# Altium schematic sheet [1]-COVER_PAGE.SchDoc
size A4
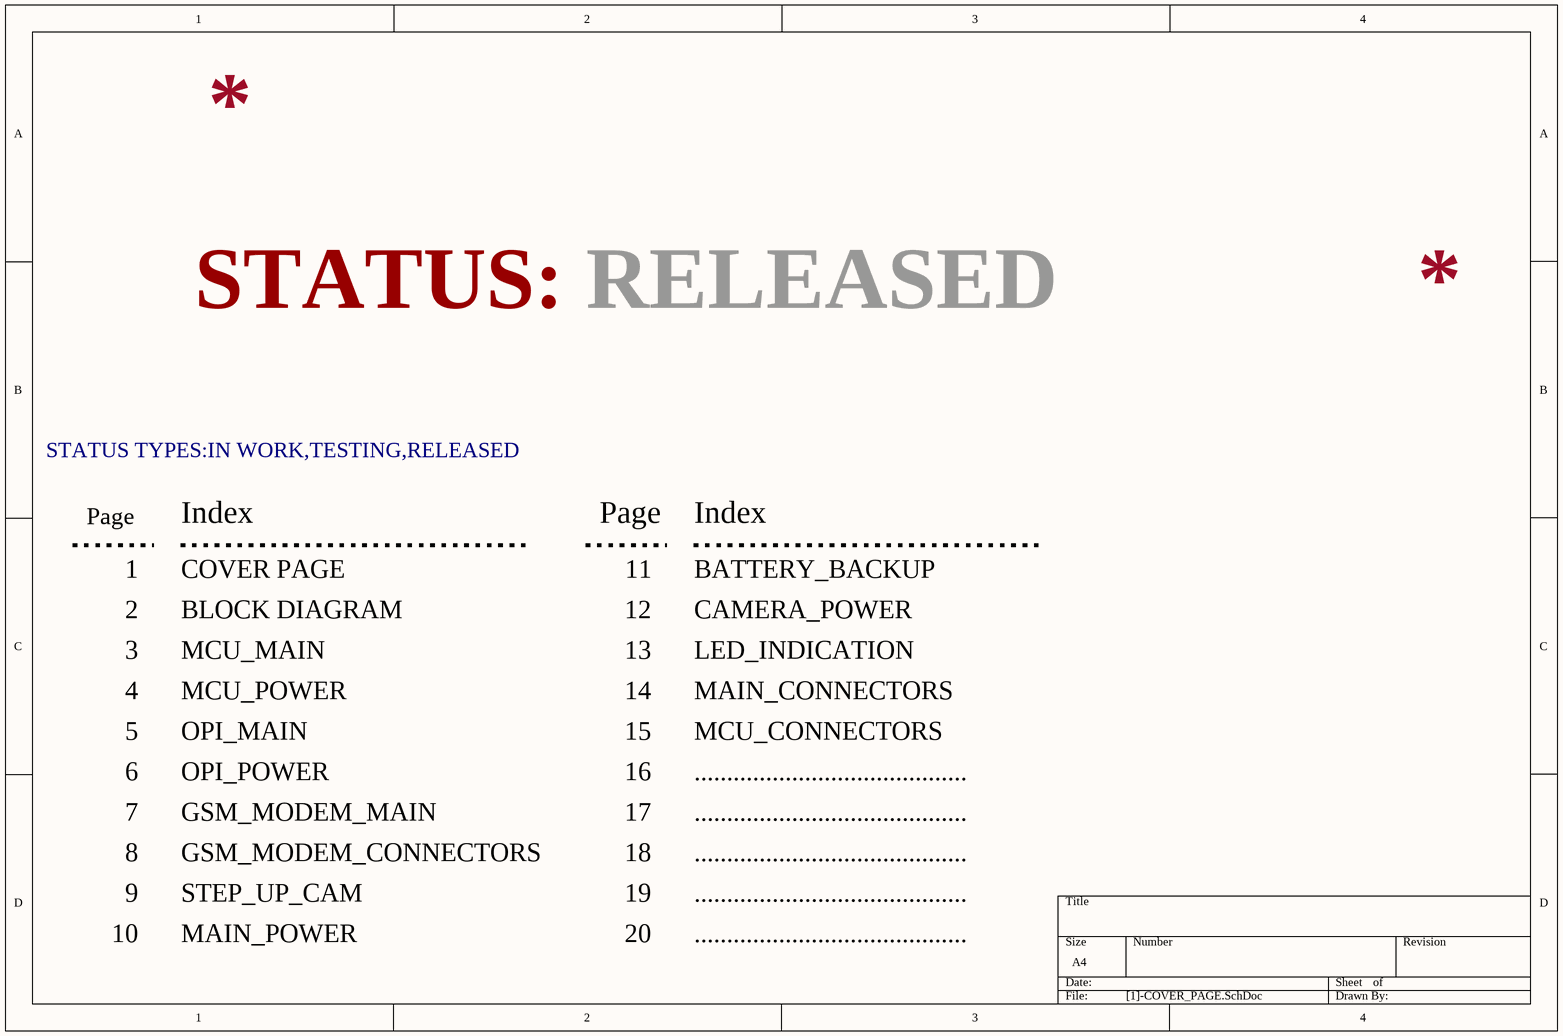
[diagram p0: [1]-COVER_PAGE.SchDoc]

## Notes on the sheet
- STATUS:
- RELEASED
- STATUS TYPES:IN WORK,TESTING,RELEASED
- Page
- 1
- Index
- COVER PAGE
- 11
- BATTERY_BACKUP
- 2
- BLOCK DIAGRAM
- 12
- CAMERA_POWER
- 3
- 4
- MCU_MAIN
- MCU_POWER
- 13
- 14
- LED_INDICATION
- MAIN_CONNECTORS
- 5
- 6
- OPI_MAIN
- OPI_POWER
- 15
- 16
- MCU_CONNECTORS
- ..........................................
- 7
- GSM_MODEM_MAIN
- 17
- 8
- 9
- GSM_MODEM_CONNECTORS
- STEP_UP_CAM
- 18
- 19
- 10
- MAIN_POWER
- 20